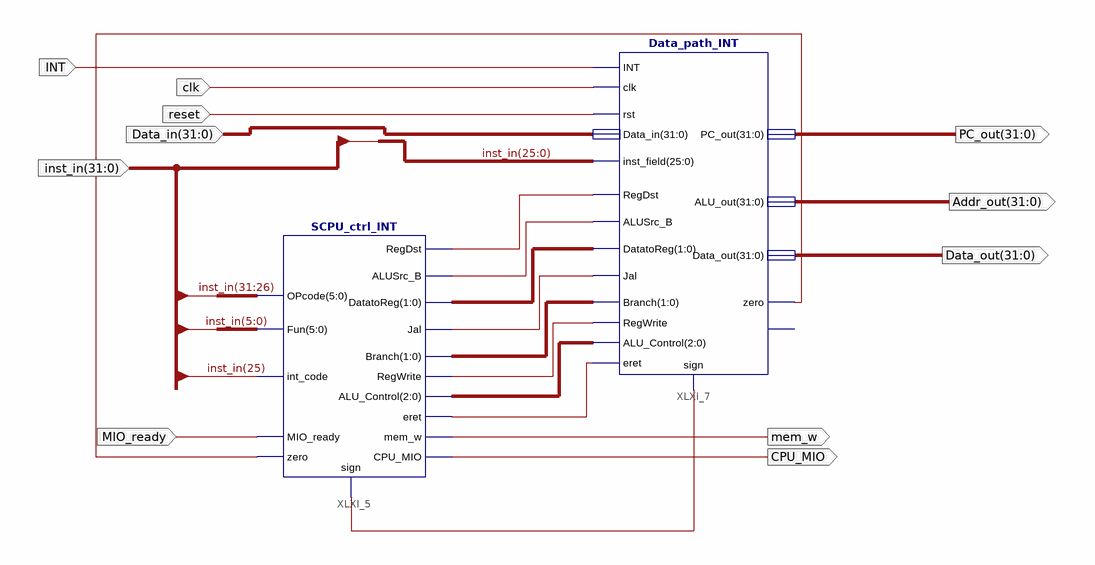
[diagram p0: schematic sheet 1]
// Xilinx ISE schematic SCPU_INT.sch (kintex7) as structural Verilog: 2 symbols, 11 ports
module SCPU_INT (
  input  clk,
  input  reset,
  input  [31:0] Data_in,
  input  [31:0] inst_in,
  input  MIO_ready,
  input  INT,
  output mem_w,
  output CPU_MIO,
  output [31:0] PC_out,
  output [31:0] Addr_out,
  output [31:0] Data_out
);

  wire XLXN_19, XLXN_20, XLXN_22, XLXN_24, XLXN_36, XLXN_44, XLXN_72;
  wire [1:0] XLXN_16, XLXN_17;
  wire [2:0] XLXN_13;

  SCPU_ctrl_INT XLXI_5 (
    .RegDst(XLXN_19), .ALUSrc_B(XLXN_20), .DatatoReg(XLXN_16), .Jal(XLXN_22), .Fun(inst_in[5:0]),
    .OPcode(inst_in[31:26]), .MIO_ready(MIO_ready), .zero(XLXN_44), .CPU_MIO(CPU_MIO), .mem_w(mem_w),
    .Branch(XLXN_17), .RegWrite(XLXN_24), .eret(XLXN_36), .ALU_Control(XLXN_13), .int_code(inst_in[25]),
    .sign(XLXN_72));
  Data_path_INT XLXI_7 (
    .RegDst(XLXN_19), .ALUSrc_B(XLXN_20), .DatatoReg(XLXN_16), .Jal(XLXN_22), .Branch(XLXN_17),
    .Data_in(Data_in), .inst_field(inst_in[25:0]), .clk(clk), .rst(reset), .PC_out(PC_out),
    .ALU_out(Addr_out), .Data_out(Data_out), .zero(XLXN_44), .RegWrite(XLXN_24), .ALU_Control(XLXN_13),
    .eret(XLXN_36), .INT(INT), .sign(XLXN_72));  // open: overflow
endmodule
